# Altium schematic sheet BaseBand.SchDoc
size A4; SheetNumber: 2; SheetTotal: 4
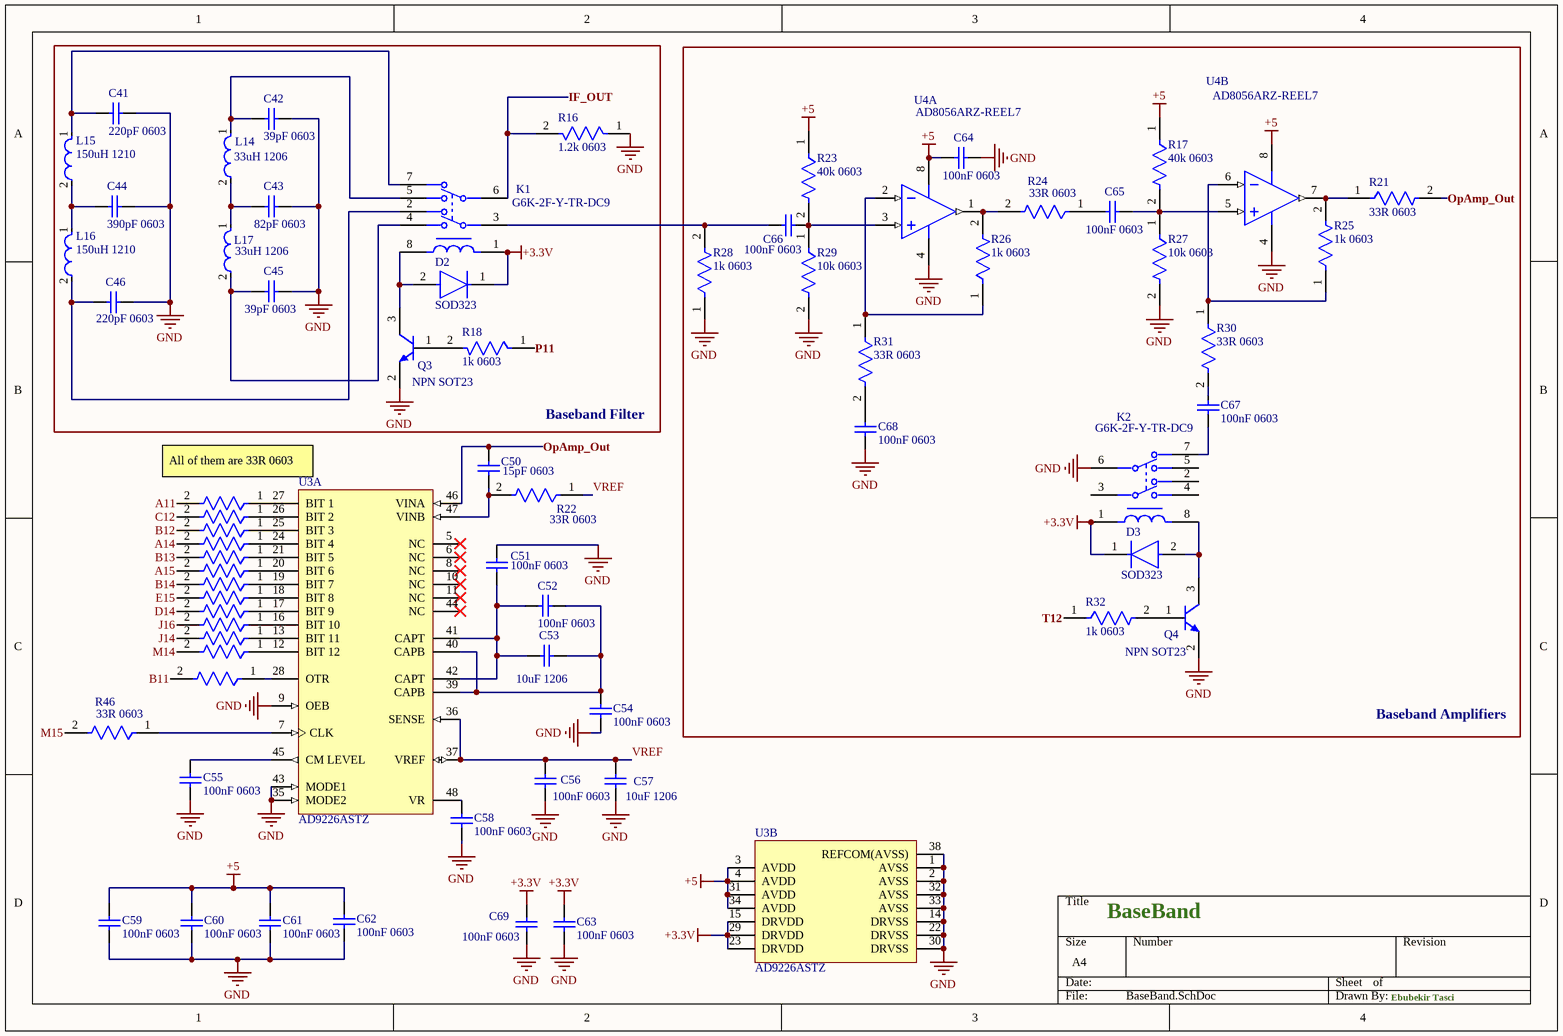
[diagram p0: BaseBand.SchDoc]

## Parts
C41  220pF 0603  [CAPC1608X92X38LL15T08]
C42  39pF 0603  [CAPC1608X92X38LL15T08]
C43  82pF 0603  [CAPC1608X92X38LL15T08]
C44  390pF 0603  [CAPC1608X92X38LL15T08]
C45  39pF 0603  [CAPC1608X92X38LL15T08]
C46  220pF 0603  [CAPC1608X92X38LL15T08]
C50  15pF 0603  [CAPC1608X92X38LL15T08]
C51  100nF 0603  [CAPC0603(1608)100_L]
C52  100nF 0603  [CAPC0603(1608)100_L]
C53  10uF 1206  [CAPC1206(3216)190_M]
C54  100nF 0603  [CAPC0603(1608)100_L]
C55  100nF 0603  [CAPC0603(1608)100_L]
C56  100nF 0603  [CAPC0603(1608)100_L]
C57  10uF 1206  [CAPC1206(3216)190_M]
C58  100nF 0603  [CAPC0603(1608)100_L]
C59  100nF 0603  [CAPC0603(1608)100_L]
C60  100nF 0603  [CAPC0603(1608)100_L]
C61  100nF 0603  [CAPC0603(1608)100_L]
C62  100nF 0603  [CAPC0603(1608)100_L]
C63  100nF 0603  [CAPC0603(1608)100_L]
C64  100nF 0603  [CAPC0603(1608)100_L]
C65  100nF 0603  [CAPC0603(1608)100_L]
C66  100nF 0603  [CAPC0603(1608)100_L]
C67  100nF 0603  [CAPC0603(1608)100_L]
C68  100nF 0603  [CAPC0603(1608)100_L]
C69  100nF 0603  [CAPC0603(1608)100_L]
D2  SOD323  [FP-SOD323F-MFG]
D3  SOD323  [FP-SOD323F-MFG]
K1  G6K-2F-Y-TR-DC9  [FP-G6K-2F-Y-TR-DC9-MFG]
K2  G6K-2F-Y-TR-DC9  [FP-G6K-2F-Y-TR-DC9-MFG]
L14  33uH 1206  [FP-CB3225-IPC_A]
L15  150uH 1210  [FP-LQH32CH_23-MFG]
L16  150uH 1210  [FP-LQH32CH_23-MFG]
L17  33uH 1206  [FP-CB3225-IPC_A]
Q3  NPN SOT23  [ONSC-SOT-23-3-318-08_V]
Q4  NPN SOT23  [ONSC-SOT-23-3-318-08_V]
R16  1.2k 0603  [FP-CPF0603-MFG]
R17  40k 0603  [FP-CPF0603-MFG]
R18  1k 0603  [FP-CPF0603-MFG]
R21  33R 0603  [FP-CPF0603-MFG]
R22  33R 0603  [FP-CPF0603-MFG]
R23  40k 0603  [FP-CPF0603-MFG]
R24  33R 0603  [FP-CPF0603-MFG]
R25  1k 0603  [FP-CPF0603-MFG]
R26  1k 0603  [FP-CPF0603-MFG]
R27  10k 0603  [FP-CPF0603-MFG]
R28  1k 0603  [FP-CPF0603-MFG]
R29  10k 0603  [FP-CPF0603-MFG]
R30  33R 0603  [FP-CPF0603-MFG]
R31  33R 0603  [FP-CPF0603-MFG]
R32  1k 0603  [FP-CPF0603-MFG]
R33  33R 0603  [FP-CPF0603-MFG]  (value not drawn)
R34  33R 0603  [FP-CPF0603-MFG]  (value not drawn)
R35  33R 0603  [FP-CPF0603-MFG]  (value not drawn)
R36  33R 0603  [FP-CPF0603-MFG]  (value not drawn)
R37  33R 0603  [FP-CPF0603-MFG]  (value not drawn)
R38  33R 0603  [FP-CPF0603-MFG]  (value not drawn)
R39  33R 0603  [FP-CPF0603-MFG]  (value not drawn)
R40  33R 0603  [FP-CPF0603-MFG]  (value not drawn)
R41  33R 0603  [FP-CPF0603-MFG]  (value not drawn)
R42  33R 0603  [FP-CPF0603-MFG]  (value not drawn)
R43  33R 0603  [FP-CPF0603-MFG]  (value not drawn)
R44  33R 0603  [FP-CPF0603-MFG]  (value not drawn)
R45  33R 0603  [FP-CPF0603-MFG]  (value not drawn)
R46  33R 0603  [FP-CPF0603-MFG]
U3  AD9226ASTZ  [ST-48_N]  (parts A,B of 2)
U4  AD8056ARZ-REEL7  [ADI-R-8_M]  (parts A,B of 2)

## Blocks framed on the sheet
Baseband Filter: C41-C46 D2 K1 L14-L17 Q3 R16 R18
Baseband Amplifiers: C64-C68 D3 K2 Q4 R17 R21 R23-R32 U4

## Nets
+3.3V: C63.1 C69.1 D2.1(C) D3.1(C) K1.1 K2.1 U3.15(DRVDD) U3.23(DRVDD) U3.29(DRVDD)
+5: C59.1 C60.1 C61.1 C62.1 C64.2 R17.1 R23.1 U3.3(AVDD) U3.4(AVDD) U3.31(AVDD) U3.34(AVDD) U4.8(+VS)
GND: C41.1 C42.1 C43.1 C44.1 C45.1 C46.1 C51.2 C54.1 C55.2 C56.2 C57.1 C58.2 C59.2 C60.2 C61.2 C62.2 C63.2 C64.1 C68.2 C69.2 K2.6 Q3.2(E) Q4.2(E) R16.1 R27.2 R28.1 R29.2 U3.1(AVSS) U3.2(AVSS) U3.9(OEB) U3.14(DRVSS) U3.22(DRVSS) U3.30(DRVSS) U3.32(AVSS) U3.33(AVSS) U3.35(MODE2) U3.38(REFCOM(AVSS)) U3.43(MODE1) U4.4(-VS)
A11: R33.2
A14: R36.2
A15: R38.2
B11: R45.2
B12: R35.2
B13: R37.2
B14: R39.2
C12: R34.2
D14: R41.2
E15: R40.2
IF_OUT: K1.6 R16.2
J14: R43.2
J16: R42.2
M14: R44.2
M15: R46.2
OpAmp_Out: C50.2 R21.2 U3.46(VINA)
P11: R18.1
T12: R32.1
VREF: C56.1 C57.2 R22.1 U3.36(SENSE) U3.37(VREF)
NetC41_2: C41.2 K1.7 L15.1
NetC42_2: C42.2 K1.5 L14.1
NetC43_2: C43.2 L14.2 L17.1
NetC44_2: C44.2 L15.2 L16.1
NetC45_2: C45.2 K1.4 L17.2
NetC46_2: C46.2 K1.2 L16.2
NetC50_1: C50.1 R22.2 U3.47(VINB)
NetC51_1: C51.1 C52.1 C53.2 U3.41(CAPT) U3.42(CAPT)
NetC52_2: C52.2 C53.1 C54.2 U3.39(CAPB) U3.40(CAPB)
NetC55_1: C55.1 U3.45(CM_LEVEL)
NetC58_1: C58.1 U3.48(VR)
NetC65_1: C65.1 R17.2 R27.1 U4.5(+IN_2)
NetC65_2: C65.2 R24.1
NetC66_1: C66.1 R23.2 R29.1 U4.3(+IN_1)
NetC66_2: C66.2 K1.3 R28.2
NetC67_1: C67.1 R30.2
NetC67_2: C67.2 K2.7
NetC68_1: C68.1 R31.2
NetD2_2: D2.2(A) K1.8 Q3.3(C)
NetD3_2: D3.2(A) K2.8 Q4.3(C)
NetQ3_1: Q3.1(B) R18.2
NetQ4_1: Q4.1(B) R32.2
NetR21_1: R21.1 R25.2 U4.7(OUT_2)
NetR24_2: R24.2 R26.2 U4.1(OUT_1)
NetR25_1: R25.1 R30.1 U4.6(-IN_2)
NetR26_1: R26.1 R31.1 U4.2(-IN_1)
NetR33_1: R33.1 U3.27(BIT_1)
NetR34_1: R34.1 U3.26(BIT_2)
NetR35_1: R35.1 U3.25(BIT_3)
NetR36_1: R36.1 U3.24(BIT_4)
NetR37_1: R37.1 U3.21(BIT_5)
NetR38_1: R38.1 U3.20(BIT_6)
NetR39_1: R39.1 U3.19(BIT_7)
NetR40_1: R40.1 U3.18(BIT_8)
NetR41_1: R41.1 U3.17(BIT_9)
NetR42_1: R42.1 U3.16(BIT_10)
NetR43_1: R43.1 U3.13(BIT_11)
NetR44_1: R44.1 U3.12(BIT_12)
NetR45_1: R45.1 U3.28(OTR)
NetR46_1: R46.1 U3.7(CLK)

Not connected (* = marked no-connect by the designer): K2 2 3 4 5; U3 5(NC)* 6(NC)* 8(NC)* 10(NC)* 11(NC)* 44(NC)*

## Notes on the sheet
- All of them are 33R 0603
- BaseBand
- Ebubekir Tasci

## Library data of the parts
C41-C46 C50 = CMP-2006-01182-1: Manufacturer: Vitramon; Part Number: VJ0603A101FXAAC
C51 C52 C54-C56 C58-C69 = CMP-1035-00228-1: CAP 100nF 16V ±0.1pF 0603 (1608 Metric) Thickness 1mm SMD; Case-EIA: 0603; Tolerance: Â±0.1pF; Case-Metric: 1608; Max Thickness: 1 mm; Technology: SMT; Value: 100nF; Rated Voltage: 16 V
C53 C57 = CMP-1037-04973-1: CAP 10uF 16V ±5% 1206 (3216 Metric) Thickness 1.9mm SMD; Case-EIA: 1206; Case-Metric: 3216; Tolerance: Â±5%; Rated Voltage: 16 V; Value: 10uF; Max Thickness: 1.9 mm; Technology: SMT
D2 D3 = CMP-12791-000029-1: DIODE GEN PURP 100V 250MA SOD323; Manufacturer Part Number: 1N4148WSF-7; Manufacturer: Diodes Inc.; Value: 1.5pF; Max Surge Forward Current: 0.5A; Peak Reverse Current: 0.5uA; Max Junction Temp: +150°C; Height: 0.75mm; Digikey Description: DIODE GEN PURP 100V 250MA SOD323; Automotive: No; Footprint Url: https://www.diodes.com/assets/Package-Files/SOD323F.pdf; Category: Diode; Max Repetitive Reverse Voltage: 100V; Lead Free: Yes; Temperature Range High: +150°C; Forward Current: 250mA; Reverse Voltage: 100V; Device Class L3: Rectifier Diodes; ComponentLink2URL: https://www.diodes.com/assets/Datasheets/1N4148WSF.pdf; Package: SOD323F; RoHS: TRUE; Mouser Description: Diodes - General Purpose, Power, Switching 200mW 2pF 75Vrrm 150mA 2A 1VF; Temperature: -55°C to +150°C; Capacitance: 1.5pF; Device Class L2: Diodes; ComponentLink2Description: Datasheet; Device Class L1: Discrete Semiconductors; Octopart: https://octopart.com/1n4148wsf-7-diodes+inc.-33798544; Temperature Range Low: -55°C
K1 K2 = CMP-08823-000027-1: RELAY TELECOM DPDT 1A 9VDC; Coil Type: Non-Latching; Coil Power: 100mW; Release Time: 3ms; Coil Resistance: 795R; Max Voltage Rating (AC): 125V; Coil Current: 11.3mA; Coil Voltage (DC): 9V; Max Voltage Rating (DC): 60V; Mount: Surface Mount; Packaging: Tape and Reel; Contact Material: Gold; Package Quantity: 1800; Contact Current Rating: 1A; Power Consumption: 100mW; Lead Free: Lead Free; Radiation Hardening: No; Throw Configuration: DPDT; Min Operating Temperature: -40°C; Number of Pins: 8; RoHS Compliant: Yes; Max Current Rating: 1A; Operate Time: 3ms; Relay Type: Telecom; Max Operating Temperature: 70°C; Termination: Gull Wing; Series: G6K
L14 L17 = CMP-14484-000067-1: SMD Inductors 33uH ±10% 0.57A 0.533Ω 1210; Saturation Current: 500mA; Shielding: Unshielded; Test Frequency: 100kHz; DC Current: 570mA; DC Resistance (DCR): 533mR; Self Resonant Frequency: 13MHz; Core Material: Ferrite; Termination: SMD/SMT; Min Operating Temperature: -40°C; Width: 0.098inch; Case Code (Imperial): 1210; Depth: 2.7mm; Length: 3.2mm; Case Code (Metric): 3225; Max Operating Temperature: 105°C; Inductance: 33uH; Current Rating: 570mA; Military Standard: Not; Tolerance: 10%; Lead Free: Lead Free; Package Quantity: 1000; Height: 2.5mm; Height - Seated (Max): 0.106inch; Max DC Current: 570mA; Resistor Type: Wirewound; Series: CBC; Packaging: Tape and Reel; Halogen Free: Halogen Free; Case/Package: 1210; Radiation Hardening: No; RoHS Compliant: Yes; Mount: Surface Mount; Inductance Tolerance: 10%
L15 L16 = CMP-06042-012094-2: Wire Wound Ferrite Inductor for General Circuits 150μH ±10% 9.3Ω 70mA 1210; Q Factor: 40; Shielding: Unshielded; DC Resistance (DCR): 9.3R; Frequency: 7MHz; Test Frequency: 1MHz; Inductance: 150uH; Packaging: Tape and Reel; Series: LQH32M; Core Material: Ferrite; Min Operating Temperature: -40°C; Military Standard: Not; RoHS Compliant: Yes; Termination: SMD/SMT; Depth: 2.7mm; Radiation Hardening: No; Self Resonant Frequency: 7MHz; Max Operating Temperature: 85°C; Width: 2.5mm; Lead Free: Lead Free; Case Code (Metric): 3225; Current Rating: 70mA; Mount: Surface Mount; Package Quantity: 2000; Max DC Current: 70mA; Height: 2mm; Weight: 0.002116oz; DC Current: 70mA; Case Code (Imperial): 1210; Tolerance: 10%; Case/Package: 1210; Length: 3.2mm
Q3 Q4 = CMP-1048-00598-1: VHF / UHF Transistor, NPN Silicon, 3-Pin SOT-23, Pb-Free, Tape and Reel; Manufacturer: On Semiconductor; PartNumber: NSVMMBTH10LT1G; fT Min (MHz): 650; ComponentLink1URL: http://www.onsemi.com/; PackageReference: SOT-23-3-318-08; Mounting Technology: Surface Mount; PackageVersion: Rev. AP, 11/2009; DatasheetVersion: Rev. 5; Packing: Tape and Reel; RoHS: TRUE; ComponentLink3Description: Package Specification; Polarity: NPN; ComponentLink2URL: http://www.onsemi.cn/pub_link/Collateral/MMBTH10LT1-D.PDF; ComponentLink3URL: http://www.onsemi.cn/pub_link/Collateral/318-08.PDF; PackageDescription: 3-Pin Small Outline Transistor, Body 2.92 x 1.3 mm, Pitch 0.95 mm; ComponentLink2Description: Datasheet; ComponentLink1Description: Manufacturer URL
R16 = CMP-03211-006902-1: RES SMD 1.2kΩ 0.1% 1/16W 0603; Manufacturer Part Number: CPF0603B430RE1; Manufacturer: TE Connectivity; Power Rating: 0.063W; Temperature Coefficient: 25ppm/°C; Voltage Rating: 50V; Lead Free: Yes; Temperature: -55°C to +155°C; Device Class L3: Chip SMD Resistors; RoHS: TRUE; packaging: 1k Reel; ComponentLink2Description: Datasheet; Category: Res; Resistance: 1.2kΩ; Octopart: https://octopart.com/cpf0603b430re1-te+connectivity-22738753; Automotive: No; Height: 0.55mm; Package: CPF0603; octopart_url: https://octopart.com/cpf0603b430re1-te+connectivity-22738753; ComponentLink2URL: https://www.te.com/commerce/DocumentDelivery/DDEController?Action=showdoc&DocId=Data+Sheet%7F1773200%7FM%7Fpdf%7FEnglish%7FENG_DS_1773200_M.pdf%7F3-1676481-2; Series: CPF; Composition: Thin Film; Device Class L2: Resistors; Tolerance: 0.1%; Ipc Land Pattern Name: RESC15580X45; Value: 1.2kΩ; Device Class L1: Passive Components; Temperature Range High: +155°C; Temperature Range Low: -55°C
R17 R23 = CMP-03211-006902-1: RES SMD 40kΩ 0.1% 1/16W 0603; Manufacturer Part Number: CPF0603B430RE1; Manufacturer: TE Connectivity; Power Rating: 0.063W; Temperature Coefficient: 25ppm/°C; Voltage Rating: 50V; Lead Free: Yes; Temperature: -55°C to +155°C; Device Class L3: Chip SMD Resistors; RoHS: TRUE; packaging: 1k Reel; ComponentLink2Description: Datasheet; Category: Res; Resistance: 40kΩ; Octopart: https://octopart.com/cpf0603b430re1-te+connectivity-22738753; Automotive: No; Height: 0.55mm; Package: CPF0603; octopart_url: https://octopart.com/cpf0603b430re1-te+connectivity-22738753; ComponentLink2URL: https://www.te.com/commerce/DocumentDelivery/DDEController?Action=showdoc&DocId=Data+Sheet%7F1773200%7FM%7Fpdf%7FEnglish%7FENG_DS_1773200_M.pdf%7F3-1676481-2; Series: CPF; Composition: Thin Film; Device Class L2: Resistors; Tolerance: 0.1%; Ipc Land Pattern Name: RESC15580X45; Value: 40kΩ; Device Class L1: Passive Components; Temperature Range High: +155°C; Temperature Range Low: -55°C
R18 R25 R26 R28 R32 = CMP-03211-006902-1: RES SMD 1kΩ 0.1% 1/16W 0603; Manufacturer Part Number: CPF0603B430RE1; Manufacturer: TE Connectivity; Resistance: 1.2kΩ; Value: 1.2kΩ; Power Rating: 0.063W; Temperature Coefficient: 25ppm/°C; Voltage Rating: 50V; Lead Free: Yes; Temperature: -55°C to +155°C; Device Class L3: Chip SMD Resistors; RoHS: TRUE; packaging: 1k Reel; ComponentLink2Description: Datasheet; Category: Res; Octopart: https://octopart.com/cpf0603b430re1-te+connectivity-22738753; Automotive: No; Height: 0.55mm; Package: CPF0603; octopart_url: https://octopart.com/cpf0603b430re1-te+connectivity-22738753; ComponentLink2URL: https://www.te.com/commerce/DocumentDelivery/DDEController?Action=showdoc&DocId=Data+Sheet%7F1773200%7FM%7Fpdf%7FEnglish%7FENG_DS_1773200_M.pdf%7F3-1676481-2; Series: CPF; Composition: Thin Film; Device Class L2: Resistors; Tolerance: 0.1%; Ipc Land Pattern Name: RESC15580X45; Device Class L1: Passive Components; Temperature Range High: +155°C; Temperature Range Low: -55°C
R21 R22 = CMP-03211-011109-1: RES SMD 33Ω 0.1% 1/16W 0603; Manufacturer: TE Connectivity; Manufacturer Part Number: CPF0603B15RE; Power Rating: 0.063W; Temperature Coefficient: 25ppm/°C; Voltage Rating: 50V; Height: 0.55mm; Tolerance: 0.1%; Value: 33Ω; Device Class L1: Passive Components; Temperature Range Low: -55°C; ComponentLink2Description: Datasheet; Device Class L3: Chip SMD Resistors; Package: CPF0603; Device Class L2: Resistors; Series: CPF; Temperature: -55°C to +155°C; packaging: 5k Reel; Temperature Range High: +155°C; Automotive: No; Composition: Thin Film; Ipc Land Pattern Name: RESC15580X45; RoHS: TRUE; ComponentLink2URL: https://www.te.com/commerce/DocumentDelivery/DDEController?Action=showdoc&DocId=Data+Sheet%7F1773200%7FM%7Fpdf%7FEnglish%7FENG_DS_1773200_M.pdf%7F3-1676481-2; Category: Res; Octopart: https://octopart.com/cpf0603b15re-te+connectivity-23283246; Lead Free: Yes; Resistance: 33Ω; octopart_url: https://octopart.com/cpf0603b15re-te+connectivity-23283246
R24 R30 R31 R33-R46 = CMP-03211-006902-1: RES SMD 33Ω 0.1% 1/16W 0603; Manufacturer Part Number: CPF0603B430RE1; Manufacturer: TE Connectivity; Power Rating: 0.063W; Temperature Coefficient: 25ppm/°C; Voltage Rating: 50V; Lead Free: Yes; Temperature: -55°C to +155°C; Device Class L3: Chip SMD Resistors; RoHS: TRUE; packaging: 1k Reel; ComponentLink2Description: Datasheet; Category: Res; Resistance: 33Ω; Octopart: https://octopart.com/cpf0603b430re1-te+connectivity-22738753; Automotive: No; Height: 0.55mm; Package: CPF0603; octopart_url: https://octopart.com/cpf0603b430re1-te+connectivity-22738753; ComponentLink2URL: https://www.te.com/commerce/DocumentDelivery/DDEController?Action=showdoc&DocId=Data+Sheet%7F1773200%7FM%7Fpdf%7FEnglish%7FENG_DS_1773200_M.pdf%7F3-1676481-2; Series: CPF; Composition: Thin Film; Device Class L2: Resistors; Tolerance: 0.1%; Ipc Land Pattern Name: RESC15580X45; Value: 33Ω; Device Class L1: Passive Components; Temperature Range High: +155°C; Temperature Range Low: -55°C
R27 R29 = CMP-03211-006902-1: RES SMD 10kΩ 0.1% 1/16W 0603; Manufacturer Part Number: CPF0603B430RE1; Manufacturer: TE Connectivity; Power Rating: 0.063W; Temperature Coefficient: 25ppm/°C; Voltage Rating: 50V; Lead Free: Yes; Temperature: -55°C to +155°C; Device Class L3: Chip SMD Resistors; RoHS: TRUE; packaging: 1k Reel; ComponentLink2Description: Datasheet; Category: Res; Resistance: 10kΩ; Octopart: https://octopart.com/cpf0603b430re1-te+connectivity-22738753; Automotive: No; Height: 0.55mm; Package: CPF0603; octopart_url: https://octopart.com/cpf0603b430re1-te+connectivity-22738753; ComponentLink2URL: https://www.te.com/commerce/DocumentDelivery/DDEController?Action=showdoc&DocId=Data+Sheet%7F1773200%7FM%7Fpdf%7FEnglish%7FENG_DS_1773200_M.pdf%7F3-1676481-2; Series: CPF; Composition: Thin Film; Device Class L2: Resistors; Tolerance: 0.1%; Ipc Land Pattern Name: RESC15580X45; Value: 10kΩ; Device Class L1: Passive Components; Temperature Range High: +155°C; Temperature Range Low: -55°C
U3 = CMP-0313-00803-2: Single 12-Bit Analog-to-Digital Converter with Parallel Interface, 65MSPS, -40 to +85 degC, ST-48, Pb-Free, Tray; Generic Part Number: AD9226; Manufacturer: Analog Devices; Resolution (Bits): 12; Channels: 1; Interface: Par; Throughput Rate (SPS): 65M; ComponentLink3Description: Package Specification; Mounting Technology: Surface Mount; PartNumber: AD9226ASTZ; RoHS: Y; Packing: Tray; ComponentLink4Description: Product URL; PackageVersion: revA; ComponentLink1URL: http://www.analog.com/en/index.html; ComponentLink3URL: http://www.analog.com/static/imported-files/packages/PKG_PDF/LQFP%28ST%29/ST_48.pdf; PackageDescription: 48-Pin Thin Quad Flat Pack 0.5 mm Pitch; ComponentLink1Description: Manufacturer URL; DatasheetVersion: Rev.B; ComponentLink2Description: Datasheet; PackageReference: ST-48; ComponentLink2URL: http://www.analog.com/static/imported-files/data_sheets/AD9226.pdf; ComponentLink4URL: http://www.analog.com/en/analog-to-digital-converters/ad-converters/ad9226/products/product.html
U4 = CMP-0384-01085-1: Double Channel Low Power Operational Amplifier, 300 MHz BW, 1.4 KV/us SR, Industrial, 8-pin SOIC (R-8), Reel; Generic Part Number: AD8056; Manufacturer: Analog Devices; V Span Max: 12V; Input Offset Voltage: 3mV; Iq/Amp: 6mA; V Span Min: 8V; Small Signal Bandwidth: 300MHz; Amplifiers Per Package: 2; Input Bias Current: 400nA; Packing: Reel; Code_JEDEC: MS-012-AA; ComponentLink2URL: http://www.analog.com/static/imported-files/data_sheets/AD8055_8056.pdf; DatasheetVersion: Rev. J; Slew Rate: 1.4KV/us; ComponentLink3Description: Package Specification; ComponentLink2Description: Datasheet; ComponentLink3URL: http://www.analog.com/static/imported-files/packages/PKG_PDF/SOIC_Narrow%20(R)/R_8.pdf; PackageReference: R-8; PackageVersion: 060506-A; Mounting Technology: Surface Mount; PartNumber: AD8056ARZ-REEL7; ComponentLink1URL: http://www.analog.com/en/index.html; ComponentLink1Description: Manufacturer URL; PackageDescription: 8-Pin Standard Small Outline Package, Body 3.9 x 4.9 mm, Pitch 1.27 mm